# EasyEDA Pro project 无刷电机驱动板.epro, board PCB1
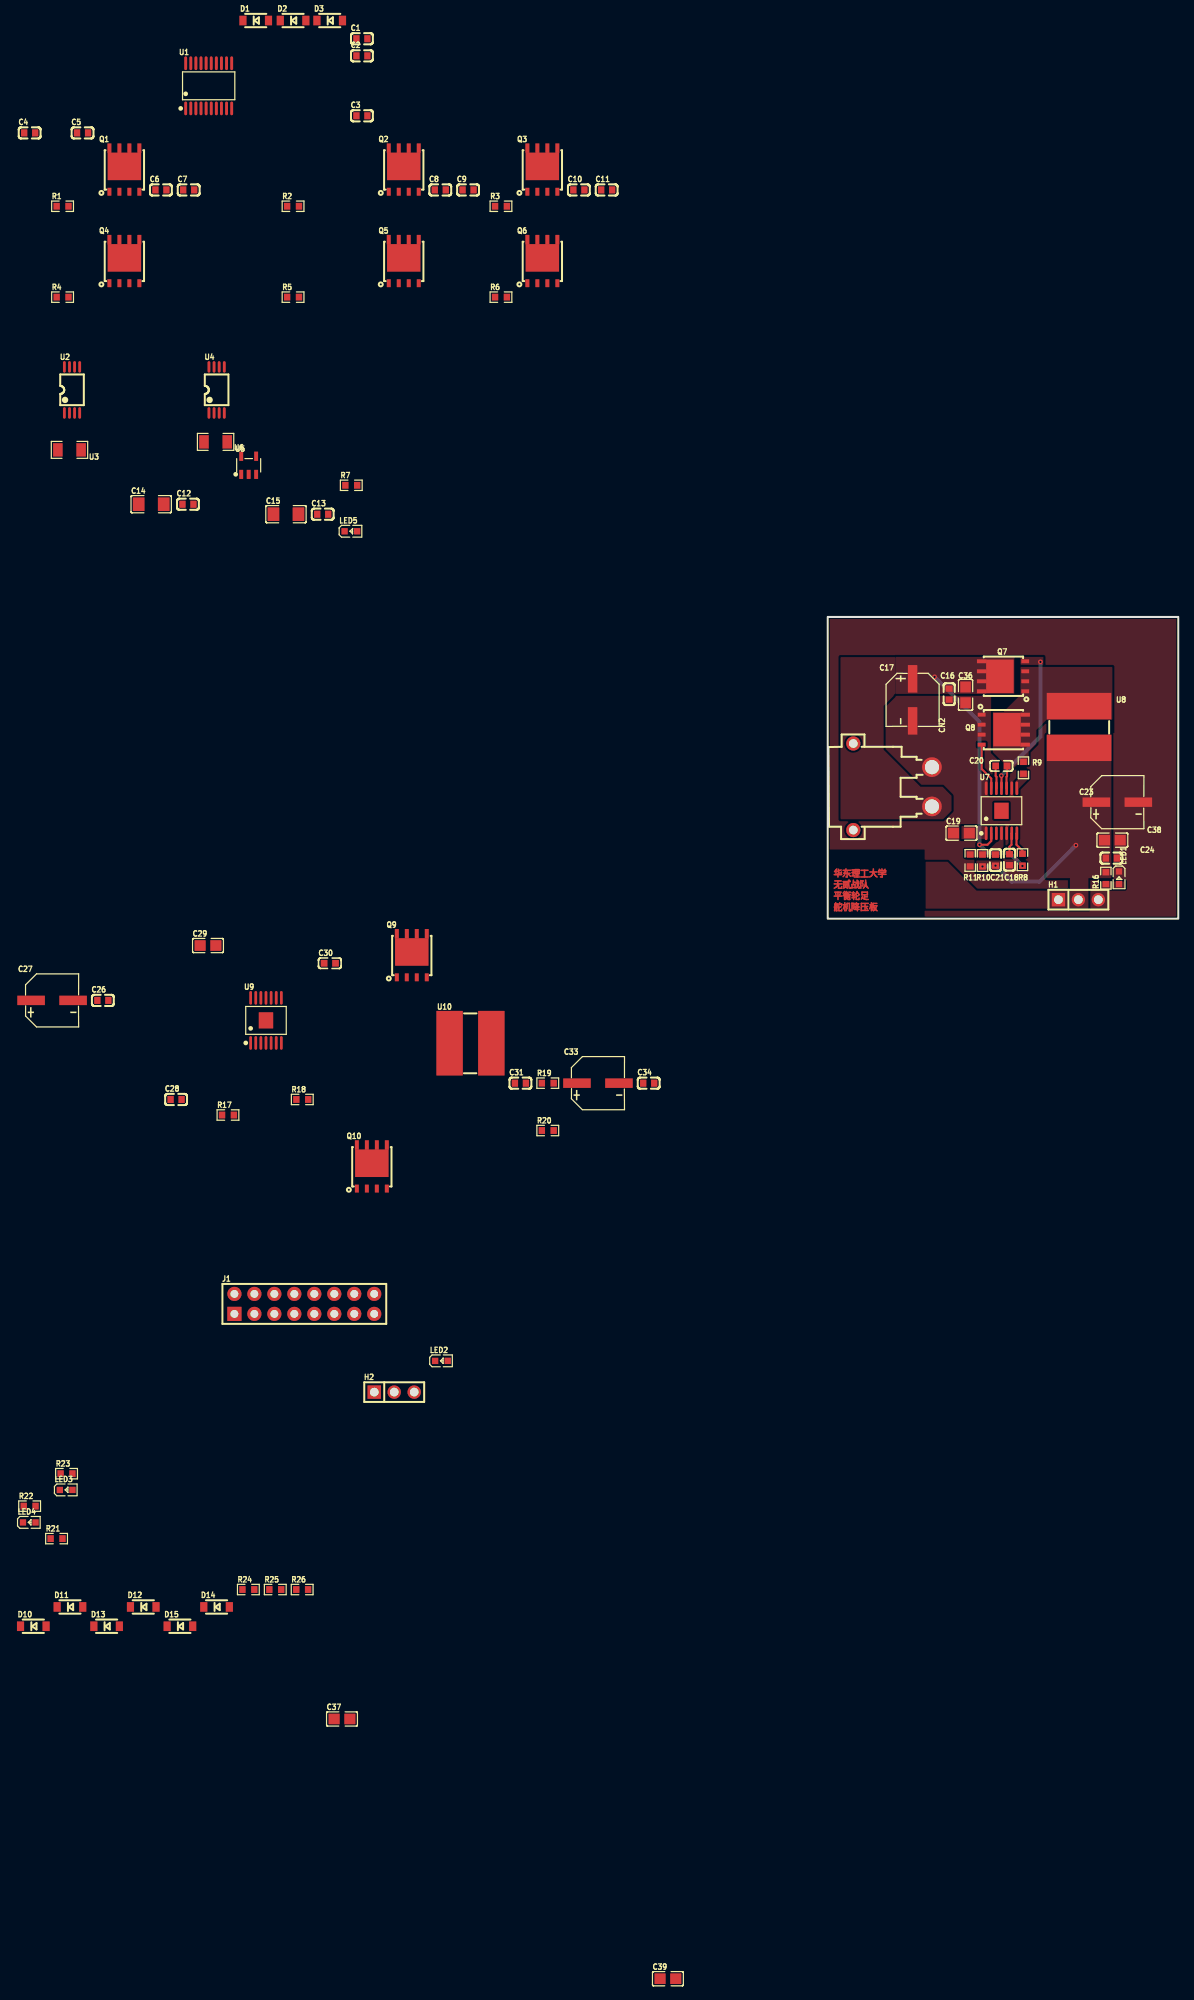
[diagram p5: board, top side]
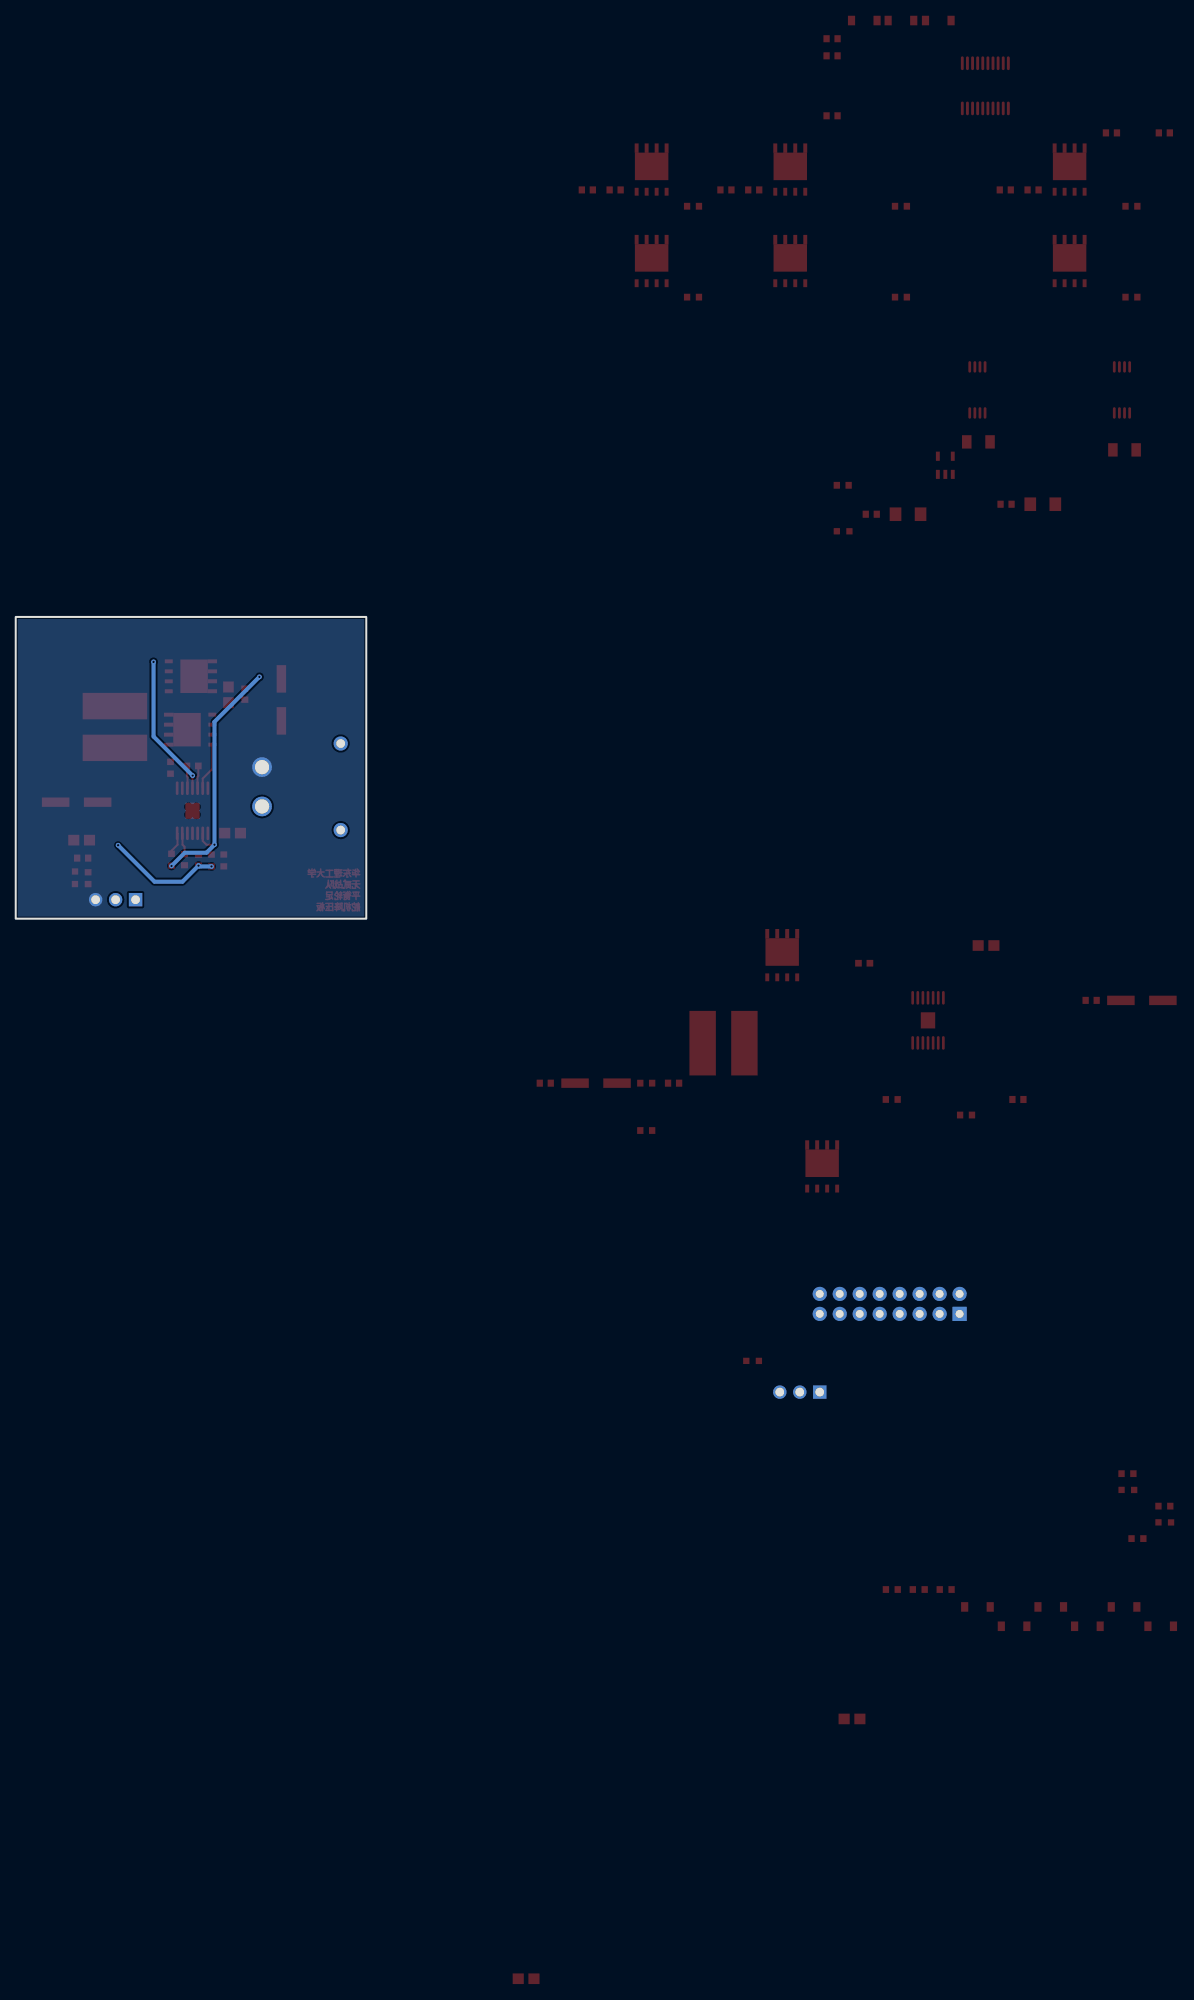
[diagram p6: board, bottom side, seen from below]

Outline 44.58 x 38.35 mm; copper layers: Top Layer, Bottom Layer. Coordinates in mm from the lower left corner of the outline.
Outline path: rectangle 0,38.35 44.58,0
Stack: Top Layer 0.035mm / Dielectric1 1.51mm FR4 er 4.5 / Bottom Layer 0.035mm

## Design rules (mm)
template: 自定义配置
spacing copperThickness1oz (default): track to track 0.102, other pairs 0.152 to 0.3
spacing copperThickness2oz: track to track 0.203, other pairs 0.152 to 0.3
track width copperThickness1oz (default): min 0.127, default 0.254, max 2.54
track width copperThickness2oz: min 0.203, default 0.254, max 2.54
differential pair differentialPair (default): width min 0.127, default 0.254, max 2.54; gap min 0.152, default 0.152
via viaSize (default): diameter min 0.5, default 0.61, max 10; hole min 0.3, default 0.305, max 6.3

## Placement (name value [footprint] x y rotation side)
C1  100nF  [C0603]  -59.23 111.85 0 top
C2  100nF  [C0603]  -59.23 109.68 0 top
C3  100nF  [C0603]  -59.23 102.06 0 top
C4  1uF  [C0603]  -101.48 99.88 0 top
C5  100nF  [C0603]  -94.76 99.88 0 top
C6  10uF  [C0603]  -84.79 92.63 0 top
C7  10uF  [C0603]  -81.26 92.63 0 top
C8  10uF  [C0603]  -49.27 92.63 0 top
C9  10uF  [C0603]  -45.73 92.63 0 top
C10  10uF  [C0603]  -31.64 92.63 0 top
C11  10uF  [C0603]  -28.11 92.63 0 top
C12  100nF  [C0603]  -81.35 52.68 0 top
C13  100nF  [C0603]  -64.22 51.41 0 top
C14  10uF  [C1206]  -86.03 52.68 0 top
C15  10uF  [C1206]  -68.89 51.41 0 top
C16  100nF  [C0603]  15.44 28.54 90 top
C17  220uF  [CAP-SMD_BD6.3-L6.6-W6.6-LS7.4-FD]  10.8 27.81 270 top
C18  15nF  [C0603]  23.11 7.49 90 top
C19  2.2uF  [C0805]  17 10.87 0 top
C20  470nF  [CAP-SMD_L1.6-W0.8-3]  22.08 19.42 180 top
C21  270pF  [C0603]  21.33 7.44 270 top
C23  220uF  [CAP-SMD_BD6.3-L6.6-W6.6-LS7.4-FD]  36.83 14.81 0 top
C24  100nF  [C0603]  36.07 7.69 180 top
C26  100nF  [C0603]  -92.18 -10.39 0 top
C27  220uF  [CAP-SMD_BD6.3-L6.6-W6.6-LS7.4-FD]  -98.63 -10.39 0 top
C28  15nF  [C0603]  -82.86 -22.98 0 top
C29  2.2uF  [C0805]  -78.8 -3.42 0 top
C30  470nF  [CAP-SMD_L1.6-W0.8-3]  -63.31 -5.67 0 top
C31  270pF  [C0603]  -39.08 -20.91 0 top
C33  220uF  [CAP-SMD_BD6.3-L6.6-W6.6-LS7.4-FD]  -29.22 -20.91 0 top
C34  100nF  [C0603]  -22.76 -20.91 0 top
C36  10uF  [C0805]  17.53 28.45 90 top
C37  10uF  [C0805]  -61.76 -101.73 0 top
C38  10uF  [C0805]  36.2 9.98 180 top
C39  10uF  [C0805]  -20.32 -134.75 0 top
CN2  XT30PW-M30.G.Y  [CONN-TH_XT30PW-M]  8.26 16.76 270 top
D1  1N5819W  [SOD-123_L2.7-W1.6-LS3.7-R-RD]  -72.74 114.16 0 top
D2  1N5819W  [SOD-123_L2.7-W1.6-LS3.7-R-RD]  -67.99 114.16 0 top
D3  1N5819W  [SOD-123_L2.7-W1.6-LS3.7-R-RD]  -63.33 114.16 0 top
D10  1N5819W  [SOD-123_L2.7-W1.6-LS3.7-R-RD]  -101.02 -89.94 0 top
D11  1N5819W  [SOD-123_L2.7-W1.6-LS3.7-R-RD]  -96.36 -87.49 0 top
D12  1N5819W  [SOD-123_L2.7-W1.6-LS3.7-R-RD]  -87.04 -87.49 0 top
D13  1N5819W  [SOD-123_L2.7-W1.6-LS3.7-R-RD]  -91.7 -89.94 0 top
D14  1N5819W  [SOD-123_L2.7-W1.6-LS3.7-R-RD]  -77.72 -87.49 0 top
D15  1N5819W  [SOD-123_L2.7-W1.6-LS3.7-R-RD]  -82.38 -89.94 0 top
H1  PZ254V-11-03P  [HDR-TH_3P-P2.54-V-M]  31.88 2.41 0 top
H2  PZ254V-11-03P  [HDR-TH_3P-P2.54-V-M]  -55.12 -60.18 0 top
J1  2.54-2*8P母  [HDR-TH_16P-P2.54-V-F-R2-C8-S2.54]  -66.55 -48.97 0 top
LED1  -  [LED_0603]  37.05 5.15 270 top
LED2  -  [LED_0603]  -49.07 -56.2 0 top
LED3  -  [LED_0603]  -96.79 -72.61 0 top
LED4  -  [LED_0603]  -101.48 -76.74 0 top
LED5  -  [LED_0603]  -60.59 49.25 0 top
Q1  TPH1R403NL  [DSOP-8_L5.0-W5.0-P1.27-LS6.0-BL-EP]  -89.44 95.17 0 top
Q2  TPH1R403NL  [DSOP-8_L5.0-W5.0-P1.27-LS6.0-BL-EP]  -53.91 95.17 0 top
Q3  TPH1R403NL  [DSOP-8_L5.0-W5.0-P1.27-LS6.0-BL-EP]  -36.29 95.17 0 top
Q4  TPH1R403NL  [DSOP-8_L5.0-W5.0-P1.27-LS6.0-BL-EP]  -89.44 83.54 0 top
Q5  TPH1R403NL  [DSOP-8_L5.0-W5.0-P1.27-LS6.0-BL-EP]  -53.91 83.54 0 top
Q6  TPH1R403NL  [DSOP-8_L5.0-W5.0-P1.27-LS6.0-BL-EP]  -36.29 83.54 0 top
Q7  TPH1R403NL  [DSOP-8_L5.0-W5.0-P1.27-LS6.0-BL-EP]  22.35 30.81 90 top
Q8  TPH1R403NL  [DSOP-8_L5.0-W5.0-P1.27-LS6.0-BL-EP]  22.35 24.02 270 top
Q9  TPH1R403NL  [DSOP-8_L5.0-W5.0-P1.27-LS6.0-BL-EP]  -52.89 -4.69 0 top
Q10  TPH1R403NL  [DSOP-8_L5.0-W5.0-P1.27-LS6.0-BL-EP]  -57.97 -31.54 0 top
R1  10Ω  [R0603]  -97.3 90.56 0 top
R2  10Ω  [R0603]  -67.99 90.56 0 top
R3  10Ω  [R0603]  -41.55 90.56 0 top
R4  10Ω  [R0603]  -97.3 79.01 0 top
R5  10Ω  [R0603]  -67.99 79.01 0 top
R6  10Ω  [R0603]  -41.55 79.01 0 top
R7  2.7k  [R0603]  -60.59 55.09 0 top
R8  267kΩ  [R0603]  24.77 7.49 90 top
R9  1.37kΩ  [R0603]  24.89 19.18 90 top
R10  113kΩ  [R0603]  19.68 7.39 270 top
R11  10kΩ  [R0603]  18.12 7.4 90 top
R16  2.8kΩ  [R0603]  35.37 5.15 90 top
R17  267kΩ  [R0603]  -76.26 -24.96 0 top
R18  1.37kΩ  [R0603]  -66.82 -22.98 0 top
R19  113kΩ  [R0603]  -35.6 -20.91 0 top
R20  10kΩ  [R0603]  -35.6 -26.93 0 top
R21  4.7kΩ  [R0603]  -98.06 -78.8 0 top
R22  5.6kΩ  [R0603]  -101.48 -74.68 0 top
R23  2.7kΩ  [R0603]  -96.79 -70.55 0 top
R24  10kΩ  [R0603]  -73.67 -85.28 0 top
R25  10kΩ  [R0603]  -70.25 -85.28 0 top
R26  10kΩ  [R0603]  -66.83 -85.28 0 top
U1  EG2133  [TSSOP-20_L6.5-W4.4-P0.65-LS6.4-BL]  -78.72 105.87 0 top
U2  INA240A2PWR  [TSSOP-8_L4.4-W3.0-P0.65-LS6.4-BL]  -96.09 67.21 0 top
U3  10mΩ  [R1206]  -96.42 59.59 180 top
U4  INA240A2PWR  [TSSOP-8_L4.4-W3.0-P0.65-LS6.4-BL]  -77.71 67.21 0 top
U5  10mΩ  [R1206]  -77.84 60.61 180 top
U6  RT9013-33GB  [SOT-23-5_L3.0-W1.7-P0.95-LS2.8-BL]  -73.63 57.63 0 top
U7  LM3150MHX/NOPB  [HTSSOP-14_L5.0-W4.4-P0.65-LS6.4-BL-EP]  22.1 13.72 0 top
U8  3.3uH  [IND-SMD_L7.8-W7.6]  31.97 24.37 90 top
U9  LM3150MHX/NOPB  [HTSSOP-14_L5.0-W4.4-P0.65-LS6.4-BL-EP]  -71.43 -12.93 0 top
U10  3.3uH  [IND-SMD_L7.8-W7.6]  -45.43 -15.83 0 top

## Footprints (pads in the part's own frame, mm; a bottom-side part is the same pattern mirrored in y, then rotated)
C0603
  rect 0.8x0.9 smd: 1(-0.7,0) 2(0.7,0)
C0805
  rect 1.41x1.35 smd: 1(-1,0) 2(1,0)
C1206
  rect 1.485x1.728 smd: 1(-1.593,0) 2(1.593,0)
CAP-SMD_BD6.3-L6.6-W6.6-LS7.4-FD
  rect 3.5x1.2 smd: 1(-2.67,0) 2(2.67,0)
CAP-SMD_L1.6-W0.8-3
  rect 0.85x0.85 smd: 1(-0.725,0) 2(0.725,0)
CONN-TH_XT30PW-M
  round 2.5 hole 1.8: 1(-2.5,5) 2(2.5,5)
  round 1.8 hole 1.1: 3(5.5,-5) 4(-5.5,-5)
DSOP-8_L5.0-W5.0-P1.27-LS6.0-BL-EP
  rect 0.5x1 smd: 1(-1.905,-2.77) 2(-0.635,-2.77) 3(0.634,-2.77) 4(1.905,-2.77)
  rect 0.5x1.2 smd: 5(1.905,2.77) 6(0.635,2.77) 7(-0.634,2.77) 8(-1.905,2.77)
  custom 4.25x3.5 smd: 9(0,0.45)
HDR-TH_3P-P2.54-V-M
  rect 1.7x1.7 hole 1.1: 1(-2.54,0)
  round 1.7 hole 1.1: 2(0,0) 3(2.54,0)
HDR-TH_16P-P2.54-V-F-R2-C8-S2.54
  rect 1.8x1.8 hole 1: 1(-8.89,-1.27)
  round 1.8 hole 1: 2(-8.89,1.27) 3(-6.35,-1.27) 4(-6.35,1.27) 5(-3.81,-1.27) 6(-3.81,1.27) 7(-1.27,-1.27) 8(-1.27,1.27) 9(1.27,-1.27) 10(1.27,1.27) 11(3.81,-1.27) 12(3.81,1.27) 13(6.35,-1.27) 14(6.35,1.27) 15(8.89,-1.27) 16(8.89,1.27)
HTSSOP-14_L5.0-W4.4-P0.65-LS6.4-BL-EP
  oval 0.343x1.732 smd: 1(-1.95,-2.866) 2(-1.3,-2.866) 3(-0.65,-2.866) 4(0,-2.866) 5(0.65,-2.866) 6(1.3,-2.866) 7(1.95,-2.866) 8(1.95,2.866) 9(1.3,2.866) 10(0.65,2.866) 11(0,2.866) 12(-0.65,2.866) 13(-1.3,2.866) 14(-1.95,2.866)
  rect 1.83x2.055 smd: 15(0,0)
IND-SMD_L7.8-W7.6
  rect 3.36x8.208 smd: 1(2.655,0) 2(-2.655,0)
LED_0603
  rect 0.8x0.8 smd: 1(-0.851,-0.01) 2(0.75,-0.005)
R0603
  rect 0.806x0.864 smd: 1(-0.753,0) 2(0.753,0)
R1206
  rect 1.208x1.701 smd: 1(-1.479,0) 2(1.479,0)
SOD-123_L2.7-W1.6-LS3.7-R-RD
  rect 0.909x1.219 smd: 1(1.625,0) 2(-1.625,0)
SOT-23-5_L3.0-W1.7-P0.95-LS2.8-BL
  rect 0.49x1.157 smd: 1(-0.95,-1.153) 2(0,-1.153) 3(0.95,-1.153)
  rect 0.49x1.175 smd: 4(0.95,1.153) 5(-0.95,1.153)
TSSOP-8_L4.4-W3.0-P0.65-LS6.4-BL
  oval 0.353x1.454 smd: 1(-0.975,-2.927) 2(-0.325,-2.927) 3(0.325,-2.927) 4(0.975,-2.927) 5(0.975,2.927) 6(0.325,2.927) 7(-0.325,2.927) 8(-0.975,2.927)
TSSOP-20_L6.5-W4.4-P0.65-LS6.4-BL
  oval 0.364x1.742 smd: 1(-2.925,-2.871) 2(-2.275,-2.871) 3(-1.625,-2.871) 4(-0.975,-2.871) 5(-0.325,-2.871) 6(0.325,-2.871) 7(0.975,-2.871) 8(1.625,-2.871) 9(2.275,-2.871) 10(2.925,-2.871) 11(2.925,2.871) 12(2.275,2.871) 13(1.625,2.871) 14(0.975,2.871) 15(0.325,2.871) 16(-0.325,2.871) 17(-0.975,2.871) 18(-1.625,2.871) 19(-2.275,2.871) 20(-2.925,2.871)

## Nets
3V3: C13.2 C15.2 R7.2 U2.5 U2.6 U4.5 U4.6 U6.5
7.4V_1: C21.2 C23.1 C24.2 C38.2 H1.2 R10.2 R16.2 U8.2
7.4V_2: C31.2 C33.1 C34.2 C39.2 H2.2 R19.2 R21.2 U10.2
+5V: C4.2 C5.2 C12.2 C14.2 D1.1 D2.1 D3.1 J1.2 J1.4 J1.6 J1.8 R23.2 U1.7 U6.1 U6.3
AGND: J1.10 J1.12 J1.14 J1.16 LED3.1 U2.4 U2.7 U4.4 U4.7 U9.5 U9.9
GND: C4.1 C5.1 C6.1 C7.1 C8.1 C9.1 C10.1 C11.1 C16.1 C17.2 C18.1 C19.1 C23.2 C24.1 C26.1 C27.2 C28.1 C29.1 C33.2 C34.1 C36.1 C37.1 C38.1 C39.1 CN2.1 H1.3 H2.3 LED1.1 LED2.1 LED4.1 Q4.1 Q4.2 Q4.3 Q8.1 Q8.2 Q8.3 Q10.1 Q10.2 Q10.3 R11.1 R20.1 R24.1 R25.1 R26.1 U1.8 U7.5 U7.9 U7.14 U9.14
VIN: C6.2 C7.2 C8.2 C9.2 C10.2 C11.2 C16.2 C17.1 C26.2 C27.1 C36.2 C37.2 CN2.2 Q1.5 Q1.6 Q1.7 Q1.8 Q1.9 Q2.5 Q2.6 Q2.7 Q2.8 Q2.9 Q3.5 Q3.6 Q3.7 Q3.8 Q3.9 Q7.5 Q7.6 Q7.7 Q7.8 Q7.9 Q9.5 Q9.6 Q9.7 Q9.8 Q9.9 R8.1 R17.1 R22.2 U7.2 U9.2
CURRENT1: J1.11 U2.8
CURRENT2: J1.13 U4.8
FB_1: C21.1 R10.1 R11.2 U7.4
FB_2: C31.1 R19.1 R20.2 U9.4
IN1: J1.1 R24.2 U1.1 U1.4
IN2: J1.3 R25.2 U1.2 U1.5
IN3: J1.5 R26.2 U1.3 U1.6
LG_1: Q8.4 U7.13
LG_2: Q10.4 U9.13
M0_GH1: D11.2 R1.1 U1.19
M0_GH2: D12.2 R2.1 U1.16
M0_GH3: D14.2 R3.1 U1.13
M0_GL1: D10.2 R4.1 U1.11
M0_GL2: D13.2 R5.1 U1.10
M0_GL3: D15.2 R6.1 U1.9
M0_OUT1_N: U2.3 U3.1
M0_OUT1_P: C1.2 Q1.1 Q1.2 Q1.3 Q4.5 Q4.6 Q4.7 Q4.8 Q4.9 Q5.1 Q5.2 Q5.3 Q6.1 Q6.2 Q6.3 U1.18 U2.2 U3.2
M0_OUT2_N: U4.3 U5.1
M0_OUT2_P: C2.2 Q2.1 Q2.2 Q2.3 Q5.5 Q5.6 Q5.7 Q5.8 Q5.9 U1.15 U4.2 U5.2
M0_OUT3: C3.2 Q3.1 Q3.2 Q3.3 Q6.5 Q6.6 Q6.7 Q6.8 Q6.9 U1.12
PWM1: H1.1 J1.7
PWM2: H2.1 J1.9
$1N544: C1.1 D1.2 U1.20
$1N555: C2.1 D2.2 U1.17
$1N567: C3.1 D3.2 U1.14
$1N2071: D11.1 Q1.4 R1.2
$1N3193: D12.1 Q2.4 R2.2
$1N3445: D14.1 Q3.4 R3.2
$1N3697: D10.1 Q4.4 R4.2
$1N3949: D13.1 Q5.4 R5.2
$1N4201: D15.1 Q6.4 R6.2
$1N5509: LED5.2 R7.1
$1N5510: C12.1 C13.1 C14.1 C15.1 LED5.1 U6.2
$1N6949: C18.2 U7.6
$1N7053: C19.2 U7.1
$1N7065: R8.2 U7.7
$1N7282: Q7.4 U7.11
$1N7328: C20.2 U7.12
$1N7361: R9.1 U7.8
$1N9707: LED1.2 R16.1
$1N9909: C20.1 Q7.1 Q7.2 Q7.3 Q8.5 Q8.6 Q8.7 Q8.8 Q8.9 R9.2 U7.10 U8.1
$1N10885: Q9.4 U9.11
$1N10896: C30.2 U9.12
$1N10900: C30.1 Q9.1 Q9.2 Q9.3 Q10.5 Q10.6 Q10.7 Q10.8 Q10.9 R18.2 U9.10 U10.1
$1N10916: R18.1 U9.8
$1N10943: R17.2 U9.7
$1N10946: C28.2 U9.6
$1N10950: C29.2 U9.1
$1N10954: LED2.2 R21.1
$1N12527: LED3.2 R23.1
$1N12568: LED4.2 R22.1

Pads without a net: CN2 3 4; J1 15; U2 1; U4 1; U6 4; U7 3 15; U9 3 15

## Via types
v1: diameter 0.61, hole 0.305, Top Layer to Bottom Layer, 8 vias

## Routing (per net, layer and track width the routed paths; a pad name or vN(x,y) marks a point on that pad's centre or on a via; arc(x,y) is an arc through that point)
7.4V_1: length 14.7
  Bottom Layer w0.508: v1(31.56,9.33) 26.92,4.7 23.38,4.7 v1(21.33,6.74) 21.23,6.64 v1(19.68,6.64)
VIN: length 32.9
  Top Layer w0.254: v1(19.3,9.4) 20.32,9.4 20.8,9.88 20.8,10.85
  Bottom Layer w0.508: v1(13.59,30.73) 19.3,25.02 v1(19.3,9.4) 20.32,8.38 23.08,8.38 v1(24.77,6.7)
LG_1: length 6
  Top Layer w0.254: 20.8,16.58 20.8,17.81 19.58,19.03 19.58,22.12
$1N6949: length 2.8
  Top Layer w0.254: U7.6 23.37,10.82 23.37,9.4 23.11,9.14 C18.2
$1N7065: length 2.9
  Top Layer w0.254: R8.2 24.77,8.64 24,9.4 24,10.81 U7.7
$1N7282: length 18.1
  Top Layer w0.254: U7.11 22.1,18.17 v1(22.08,18.19)
  Bottom Layer w0.508: v1(22.08,18.19) 27.05,23.16 v1(27.05,32.64)
$1N7328: length 2.9
  Top Layer w0.254: C20.2 21.36,18.14 21.46,18.03 21.46,16.6 U7.12
$1N9909: length 2.9
  Top Layer w0.254: C20.1 22.81,18.11 22.73,18.03 22.73,16.6 U7.10

## Copper pours and planes (outline as drawn; the poured copper is in the pictures)
7.4V_1 on Top Layer: 27.81,23.37 36.07,23.37 36.07,5.15 27.81,5.15
7.4V_1 on Top Layer: 18.9,7.39 22.1,7.39 22.1,5.97 18.9,5.97
7.4V_1 on Top Layer: 30.8,7.49 33.15,7.49 33.15,1.16 30.8,1.16
GND on Top Layer: 8.64,28.32 20.19,28.32 20.19,22.86 8.64,22.86
GND on Top Layer: -5.33,43.18 49.15,43.18 49.15,-4.95 -5.33,-4.95
GND on Bottom Layer: -5.33,42.67 46.86,42.67 46.86,-2.92 -5.33,-2.92
VIN on Top Layer: 8.64,33.25 1.63,33.25 1.63,12.64 14.67,12.64 15.75,13.72 15.75,15.62 14.61,16.76 11.81,16.76 7.11,21.46 7.11,27.04 8.64,28.57
VIN on Top Layer: 8.64,33.27 23.74,33.27 23.74,28.57 8.64,28.57
FB_1 on Top Layer: 17.46,7.83 22.05,7.83 22.05,8.84 22.35,9.14 22.35,11.81 21.78,11.81 21.78,10.03 20.51,8.76 17.46,8.76
PWM1 on Top Layer: 30.48,1.27 30.48,3.56 18.92,3.56 15.24,7.24 12.45,7.24 12.45,1.27
$1N7053 on Top Layer: 17,11.78 20.3,11.78 20.3,10.12 17,10.12
$1N7282 on Top Layer: 24.51,33.27 27.43,33.27 27.43,32.26 24.51,32.26
$1N7361 on Top Layer: 25.55,18.75 25.55,17.79 24.26,16.5 24.26,15.75 23.85,15.75 23.85,17.41 24.23,17.79 24.23,18.75
$1N9707 on Top Layer: 34.71,4.72 37.8,4.72 37.8,3.81 34.71,3.81
$1N9909 on Top Layer: 24.51,32 24.51,28.45 22.35,26.29 21,26.29 21,21.16 22.35,19.81 22.35,18.75 23.27,18.75 24.08,19.56 25.55,19.56 25.55,21.23 26.54,22.22 26.54,24 27.81,25.27 36.2,25.27 36.2,32

## Text on the board
Top Layer: 华东理工大学 / 无贰战队 / 平衡轮足 / 舵机降压板
